# EAGLE design rock-climbing-timer (EAGLE 9.6.2)
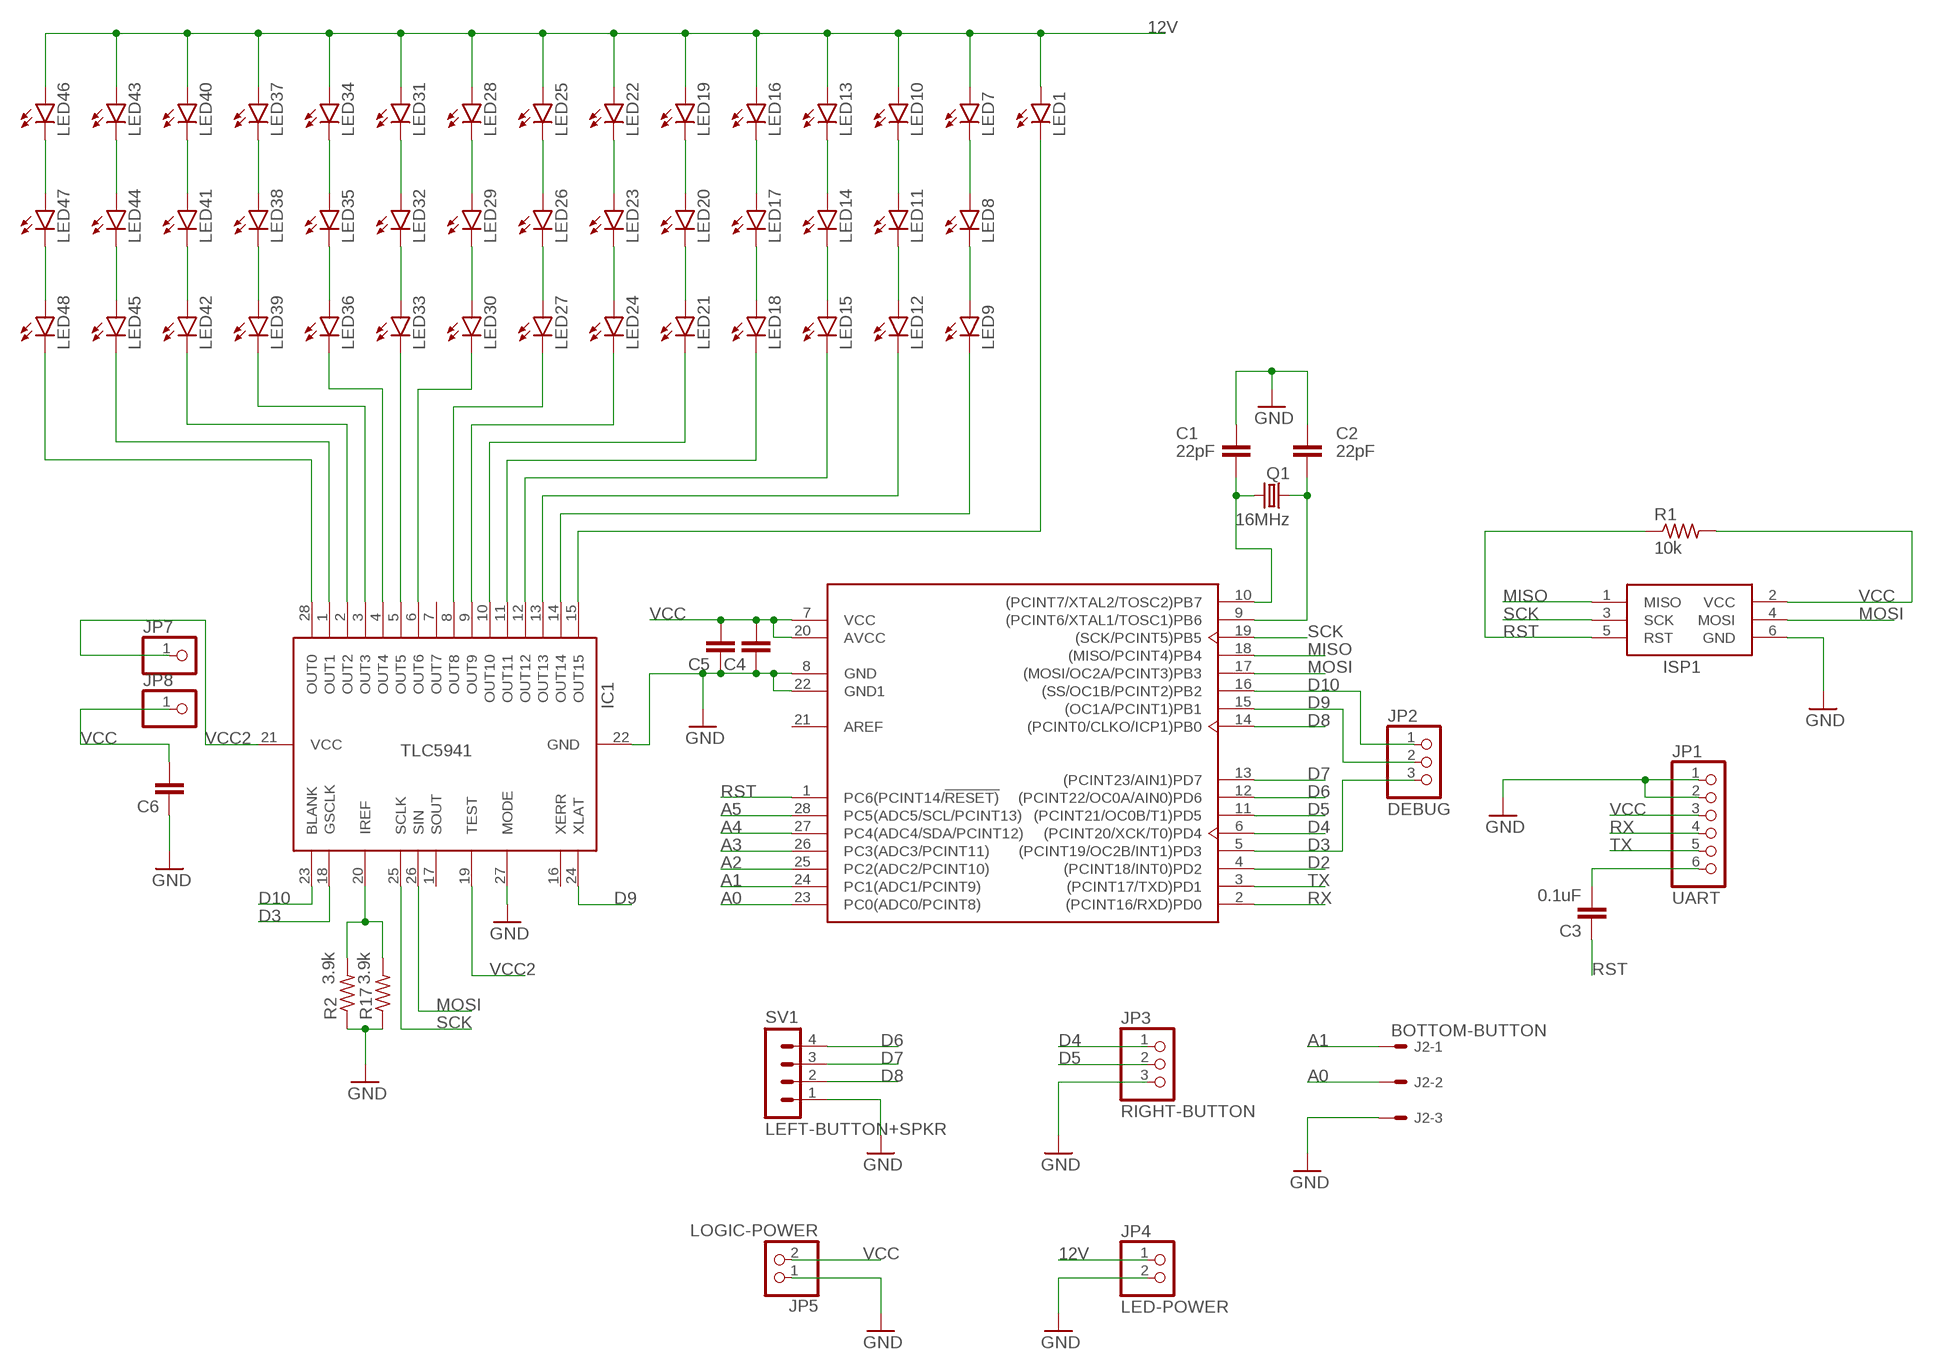
[diagram p0: schematic, sheet 1]

## Parts
C1  22pF  C5/2.5  [C5B2.5]
C2  22pF  C5/2.5  [C5B2.5]
C3  0.1uF  C5/2.5  [C5B2.5]
C4  C5/2.5  [C5B2.5]
C5  C5/2.5  [C5B2.5]
C6  C5/2.5  [C5B2.5]
IC1  TLC5941NT  [DIL28-3]
ISP1  AVRISP-6  [AVRISP]
J2  BOTTOM-BUTTON  22-27-2031-03  [6410-03]
JP1  UART  PINHD-1X6  [1X06]
JP2  DEBUG  PINHD-1X3  [1X03]
JP3  RIGHT-BUTTON  PINHD-1X3  [1X03]
JP4  LED-POWER  PINHD-1X2  [1X02]
JP5  LOGIC-POWER  PINHD-1X2  [1X02]
JP7  PINHD-1X1CB  [1X01-CLEANBIG]
JP8  PINHD-1X1CB  [1X01-CLEANBIG]
LED1  LED5MM  [LED5MM]
LED7  LED5MM  [LED5MM]
LED8  LED5MM  [LED5MM]
LED9  LED5MM  [LED5MM]
LED10  LED5MM  [LED5MM]
LED11  LED5MM  [LED5MM]
LED12  LED5MM  [LED5MM]
LED13  LED5MM  [LED5MM]
LED14  LED5MM  [LED5MM]
LED15  LED5MM  [LED5MM]
LED16  LED5MM  [LED5MM]
LED17  LED5MM  [LED5MM]
LED18  LED5MM  [LED5MM]
LED19  LED5MM  [LED5MM]
LED20  LED5MM  [LED5MM]
LED21  LED5MM  [LED5MM]
LED22  LED5MM  [LED5MM]
LED23  LED5MM  [LED5MM]
LED24  LED5MM  [LED5MM]
LED25  LED5MM  [LED5MM]
LED26  LED5MM  [LED5MM]
LED27  LED5MM  [LED5MM]
LED28  LED5MM  [LED5MM]
LED29  LED5MM  [LED5MM]
LED30  LED5MM  [LED5MM]
LED31  LED5MM  [LED5MM]
LED32  LED5MM  [LED5MM]
LED33  LED5MM  [LED5MM]
LED34  LED5MM  [LED5MM]
LED35  LED5MM  [LED5MM]
LED36  LED5MM  [LED5MM]
LED37  LED5MM  [LED5MM]
LED38  LED5MM  [LED5MM]
LED39  LED5MM  [LED5MM]
LED40  LED5MM  [LED5MM]
LED41  LED5MM  [LED5MM]
LED42  LED5MM  [LED5MM]
LED43  LED5MM  [LED5MM]
LED44  LED5MM  [LED5MM]
LED45  LED5MM  [LED5MM]
LED46  LED5MM  [LED5MM]
LED47  LED5MM  [LED5MM]
LED48  LED5MM  [LED5MM]
Q1  16MHz  CRYSTALHC49S  [HC49/S]
R1  10k  R-US_0207/10  [0207/10]
R2  3.9k  R-US_0207/10  [0207/10]
R17  3.9k  R-US_0207/10  [0207/10]
SV1  LEFT-BUTTON+SPKR  MA04-1  [MA04-1]
U1  ATMEGA328P-PU  [DIP-28]

## Nets
12V: JP4.1 LED1.A LED7.A LED10.A LED13.A LED16.A LED19.A LED22.A LED25.A LED28.A LED31.A LED34.A LED37.A LED40.A LED43.A LED46.A
A0: J2.2 U1.23(PC0(ADC0/PCINT8))
A1: J2.1 U1.24(PC1(ADC1/PCINT9))
A2: U1.25(PC2(ADC2/PCINT10))
A3: U1.26(PC3(ADC3/PCINT11))
A4: U1.27(PC4(ADC4/SDA/PCINT12))
A5: U1.28(PC5(ADC5/SCL/PCINT13))
D2: U1.4((PCINT18/INT0)PD2)
D3: IC1.18(GSCLK) JP2.3 U1.5((PCINT19/OC2B/INT1)PD3)
D4: JP3.1 U1.6((PCINT20/XCK/T0)PD4)
D5: JP3.2 U1.11((PCINT21/OC0B/T1)PD5)
D6: SV1.4 U1.12((PCINT22/OC0A/AIN0)PD6)
D7: SV1.3 U1.13((PCINT23/AIN1)PD7)
D8: SV1.2 U1.14((PCINT0/CLKO/ICP1)PB0)
D9: IC1.24(XLAT) JP2.2 U1.15((OC1A/PCINT1)PB1)
D10: IC1.23(BLANK) JP2.1 U1.16((SS/OC1B/PCINT2)PB2)
GND: C1.1 C2.1 C4.1 C5.1 C6.1 IC1.22(GND) IC1.27(MODE) ISP1.6(GND) J2.3 JP1.1 JP1.2 JP3.3 JP4.2 JP5.1 R2.1 R17.1 SV1.1 U1.8(GND) U1.22(GND1)
MISO: ISP1.1(MISO) U1.18((MISO/PCINT4)PB4)
MOSI: IC1.26(SIN) ISP1.4(MOSI) U1.17((MOSI/OC2A/PCINT3)PB3)
N$1: C1.2 Q1.2 U1.10((PCINT7/XTAL2/TOSC2)PB7)
N$2: C2.2 Q1.1 U1.9((PCINT6/XTAL1/TOSC1)PB6)
N$3: C3.2 JP1.6
N$4: IC1.20(IREF) R2.2 R17.2
N$5: IC1.15(OUT15) LED1.K(C)
N$7: LED7.K(C) LED8.A
N$8: LED8.K(C) LED9.A
N$10: LED10.K(C) LED11.A
N$11: LED11.K(C) LED12.A
N$13: LED13.K(C) LED14.A
N$14: LED14.K(C) LED15.A
N$16: LED16.K(C) LED17.A
N$17: LED17.K(C) LED18.A
N$19: LED19.K(C) LED20.A
N$20: LED20.K(C) LED21.A
N$22: LED22.K(C) LED23.A
N$23: LED23.K(C) LED24.A
N$25: LED25.K(C) LED26.A
N$26: LED26.K(C) LED27.A
N$28: LED28.K(C) LED29.A
N$29: LED29.K(C) LED30.A
N$31: LED31.K(C) LED32.A
N$32: LED32.K(C) LED33.A
N$34: LED34.K(C) LED35.A
N$35: LED35.K(C) LED36.A
N$37: LED37.K(C) LED38.A
N$38: LED38.K(C) LED39.A
N$40: LED40.K(C) LED41.A
N$41: LED41.K(C) LED42.A
N$43: LED43.K(C) LED44.A
N$44: LED44.K(C) LED45.A
N$46: LED46.K(C) LED47.A
N$47: LED47.K(C) LED48.A
N$65: IC1.14(OUT14) LED9.K(C)
N$66: IC1.13(OUT13) LED12.K(C)
N$67: IC1.12(OUT12) LED15.K(C)
N$68: IC1.11(OUT11) LED18.K(C)
N$69: IC1.10(OUT10) LED21.K(C)
N$70: IC1.9(OUT9) LED24.K(C)
N$71: IC1.8(OUT8) LED27.K(C)
N$73: IC1.6(OUT6) LED30.K(C)
N$74: IC1.5(OUT5) LED33.K(C)
N$75: IC1.4(OUT4) LED36.K(C)
N$76: IC1.3(OUT3) LED39.K(C)
N$77: IC1.2(OUT2) LED42.K(C)
N$78: IC1.1(OUT1) LED45.K(C)
N$79: IC1.28(OUT0) LED48.K(C)
RST: C3.1 ISP1.5(RST) R1.1 U1.1(PC6(PCINT14/!RESET))
RX: JP1.4 U1.2((PCINT16/RXD)PD0)
SCK: IC1.25(SCLK) ISP1.3(SCK) U1.19((SCK/PCINT5)PB5)
TX: JP1.5 U1.3((PCINT17/TXD)PD1)
VCC: C4.2 C5.2 C6.2 ISP1.2(VCC) JP1.3 JP5.2 JP8.1 R1.2 U1.7(VCC) U1.20(AVCC)
VCC2: IC1.19(TEST) IC1.21(VCC) JP7.1
Unconnected: IC1.7(OUT7) IC1.16(XERR) IC1.17(SOUT) U1.21(AREF)

## Library data of the parts
C1-C6 = capacitor-wima:C: CAPACITOR naming: grid - package width
IC1 = adafruit:TLC5941
ISP1 = adafruit:AVRISP: AVR ISP HEADER Standard 6 pin header for AVR programming
J2 = con-molex:22-?-03: CONNECTOR wire to board 2.54 mm (.1 inch) pitch header; MF: MOLEX; OC_FARNELL: unknown; OC_NEWARK: unknown
JP1 = adafruit:PINHD-1X6: PIN HEADER
JP2 JP3 = pinhead:PINHD-1X3: PIN HEADER
JP4 JP5 = Connector:PINHD-1X2: PIN HEADER; CATEGORY: CONNECTOR; SUB-CATEGORY: PIN-HEADER
JP7 JP8 = adafruit:PINHD-1X1: Pin header 1x1 for 0.1" spacing With round pins
LED1 LED7-LED48 = led:LED: LED OSRAM: - CHIPLED LG R971, LG N971, LY N971, LG Q971, LY Q971, LO R971, LY R971 LH N974, LH R974 LS Q976, LO Q976, LY Q976 LO Q996 - Hyper CHIPLED LW Q18S LB Q993, LB Q99A, LB R99A - SideLED LS A670, LO A670, LY A670, LG A670, LP A670 LB A673, LV A673, LT A673, LW A673 LH A674 LY A675 LS A676, LA A676, LO A676, LY A676, LW A676 LS A679, LY A679, LG A679 - Hyper Micro SIDELED® LS Y876, LA Y876, LO Y876, LY Y876 LT Y87S - SmartLED LW L88C, LW L88S LB L89C, LB L89S, LG L890 LS L89K, LO L89K, LY L89K LS L896, LA L896, LO L896, LY L896 - TOPLED LS T670, LO T670, LY T670, LG T670, LP T670 LSG T670, LSP T670, LSY T670, LOP T670, LYG T670 LG T671, LOG T671, LSG T671 LB T673, LV T673, LT T673, LW T673 LH T674 LS T676, LA T676, LO T676, LY T676, LB T676, LH T676, LSB T676, LW T676 LB T67C, LV T67C, LT T67C, LS T67K, LO T67K, LY T67K, LW E67C LS E67B, LA E67B, LO E67B, LY E67B, LB E67C, LV E67C, LT E67C LW T67C LS T679, LY T679, LG T679 LS T770, LO T770, LY T770, LG T770, LP T770 LB T773, LV T773, LT T773, LW T773 LH T774 LS E675, LA E675, LY E675, LS T675 LS T776, LA T776, LO T776, LY T776, LB T776 LHGB T686 LT T68C, LB T68C - Hyper Mini TOPLED® LB M676 - Mini TOPLED Santana® LG M470 LS M47K, LO M47K, LY M47K Source: http://www.osram.convergy.de LUXEON: - LUMILED® LXK2-PW12-R00, LXK2-PW12-S00, LXK2-PW14-U00, LXK2-PW14-V00 LXK2-PM12-R00, LXK2-PM12-S00, LXK2-PM14-U00 LXK2-PE12-Q00, LXK2-PE12-R00, LXK2-PE12-S00, LXK2-PE14-T00, LXK2-PE14-U00 LXK2-PB12-K00, LXK2-PB12-L00, LXK2-PB12-M00, LXK2-PB14-N00, LXK2-PB14-P00, LXK2-PB14-Q00 LXK2-PR12-L00, LXK2-PR12-M00, LXK2-PR14-Q00, LXK2-PR14-R00 LXK2-PD12-Q00, LXK2-PD12-R00, LXK2-PD12-S00 LXK2-PH12-R00, LXK2-PH12-S00 LXK2-PL12-P00, LXK2-PL12-Q00, LXK2-PL12-R00 Source: www.luxeon.com KINGBRIGHT: KA-3528ASYC Source: www.kingbright.com
Q1 = crystal:CRYSTAL: CRYSTAL; OC_FARNELL: 1667008; OC_NEWARK: unknown
R1 R2 R17 = resistor:R-US_: RESISTOR, American symbol
SV1 = con-lstb:MA04-1: PIN HEADER; OC_FARNELL: unknown; OC_NEWARK: unknown
U1 = Microcontroller:ATMEGA328P-PU: IC MCU 8BIT 32KB FLASH 28DIP Manufacturer's datasheet <http://ww1.microchip.com/downloads/en/DeviceDoc/ATmega48A-PA-88A-PA-168A-PA-328-P-DS-DS40002061A.pdf>; CREATED_BY: PCBLayout.com; DIGIKEY_PART_NUMBER: ATMEGA328P-PU-ND; MANUFACTURER: Microchip Technology; MPN: ATMEGA328P-PU; PACKAGE: DIP-28

## Board
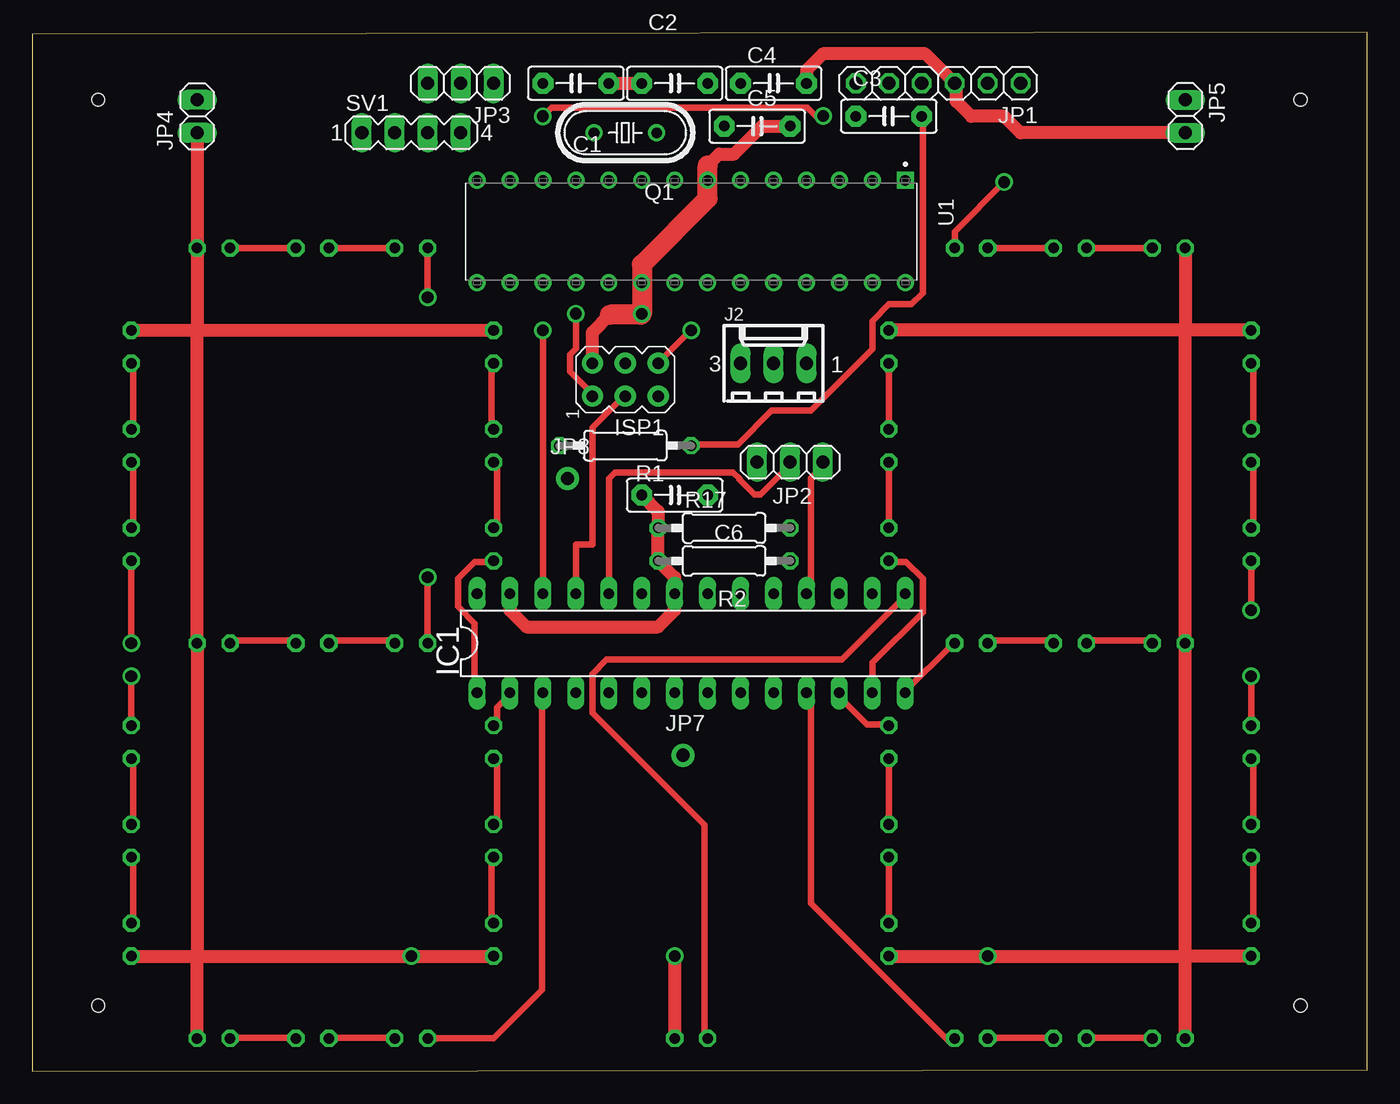
[diagram p1: board, top side]
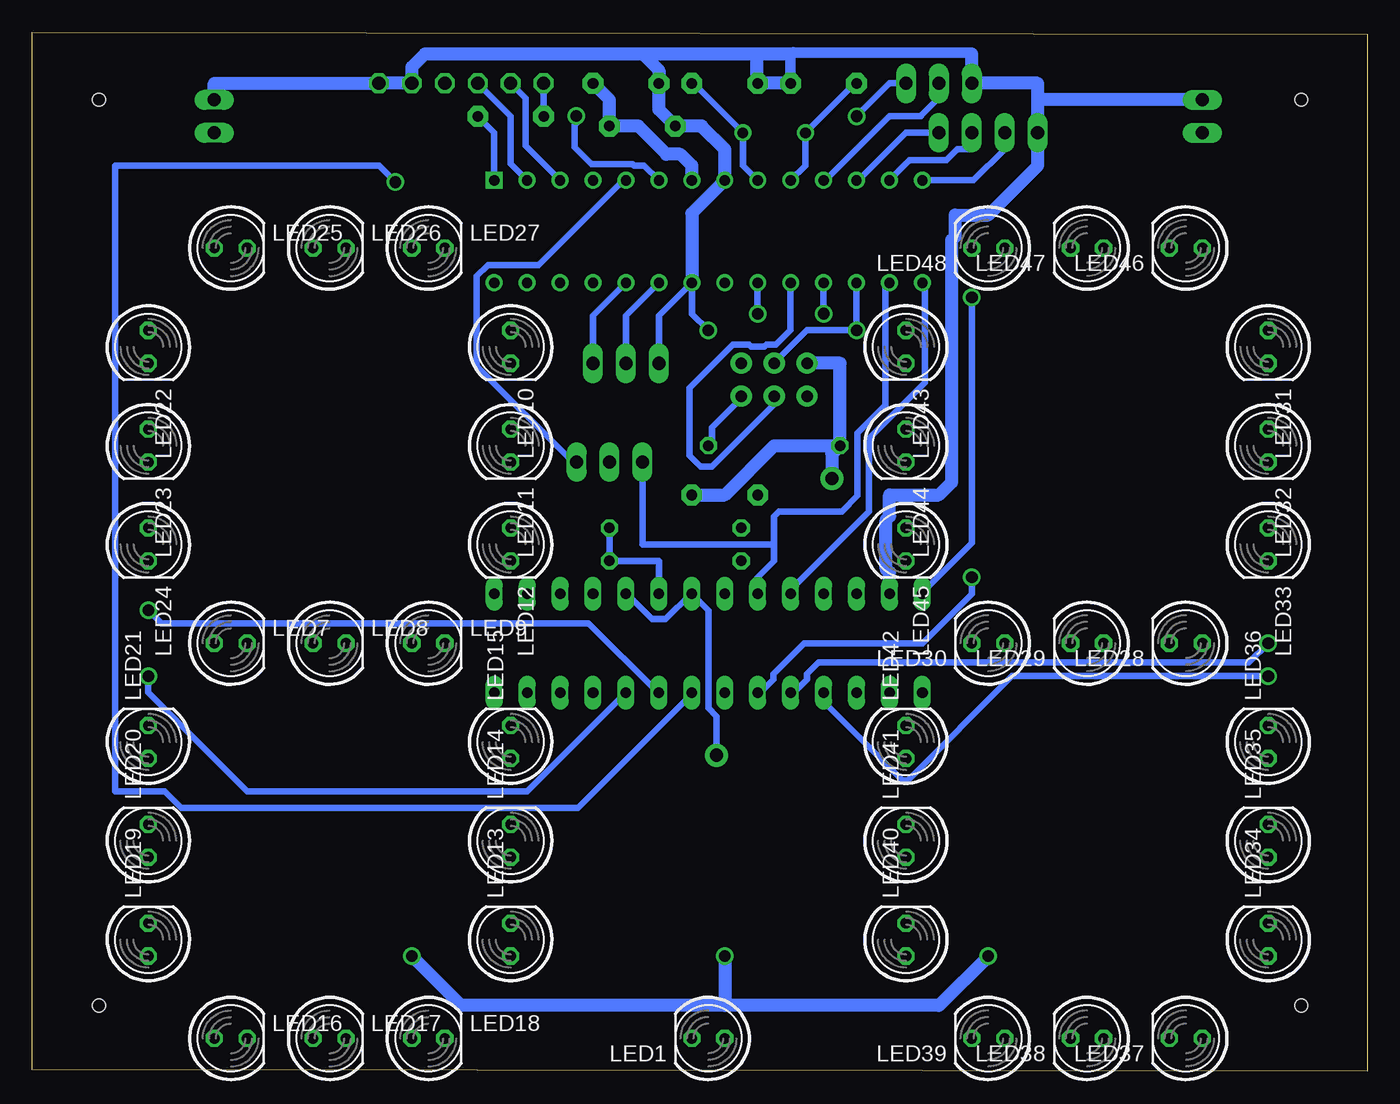
[diagram p2: board, bottom side, seen from below]

Size 102.92 x 80.13 mm. Coordinates in mm from the lower left corner, seen from the top.
Outline: 0,0 102.92,0.13 102.92,80.13 0,80 0,0
Copper layers (1*16): Top 0.035mm / dielectric 1.5mm / Bottom 0.035mm
Design rules "default *": minimum track width 20mil, minimum drill 0.35mm, track to track 14mil, track to pad 14mil, pad to pad 14mil, via to via 14mil, smd to smd 14mil, copper to edge 40mil, drill to drill 14mil, minimum pad ring 10mil, minimum via ring 8mil, stop-mask expansion 4mil, vias tented up to drill 0mil, thermal gap 14mil
Holes 1 mm at 5.08,74.93 5.08,5.08 97.79,5.08 97.79,74.93
vRestrict: area 0,0 to 100.3,80

### Footprints (pad centres in the part's own frame; a part is rotated, then mirrored left to right if it is on the bottom)
C5B2.5 = drill 0.813 pad 1.6 octagon: 1 -2.54,0; 2 2.54,0
DIL28-3 = drill 0.813 long: 1 -16.51,-3.81; 2 -13.97,-3.81; 3 -11.43,-3.81; 4 -8.89,-3.81; 5 -6.35,-3.81; 6 -3.81,-3.81; 7 -1.27,-3.81; 8 1.27,-3.81; 9 3.81,-3.81; 10 6.35,-3.81; 11 8.89,-3.81; 12 11.43,-3.81; 13 13.97,-3.81; 14 16.51,-3.81; 15 16.51,3.81; 16 13.97,3.81; 17 11.43,3.81; 18 8.89,3.81; 19 6.35,3.81; 20 3.81,3.81; 21 1.27,3.81; 22 -1.27,3.81; 23 -3.81,3.81; 24 -6.35,3.81; 25 -8.89,3.81; 26 -11.43,3.81; 27 -13.97,3.81; 28 -16.51,3.81
AVRISP = drill 0.9 pad 1.626: 1 -1.27,2.54; 2 1.27,2.54; 3 -1.27,0; 4 1.27,0; 5 -1.27,-2.54; 6 1.27,-2.54
6410-03 = drill 1.016 long: 1 2.54,0; 2 0,0; 3 -2.54,0
1X06 = drill 1.016 octagon: 1 -6.35,0; 2 -3.81,0; 3 -1.27,0; 4 1.27,0; 5 3.81,0; 6 6.35,0
1X03 = drill 1.016 long: 1 -2.54,0; 2 0,0; 3 2.54,0
1X02 = drill 1.016 long: 1 -1.27,0; 2 1.27,0
1X01-CLEANBIG = drill 1.016 pad 1.778: 1 0,0
LED5MM = drill 0.813 octagon: A -1.27,0; K 1.27,0
HC49/S = drill 0.813: 1 -2.413,0; 2 2.413,0
0207/10 = drill 0.813 octagon: 1 -5.08,0; 2 5.08,0
MA04-1 = drill 1.016 long: 1 -3.81,0; 2 -1.27,0; 3 1.27,0; 4 3.81,0
DIP-28 = drill 0.79 pad 1.19 square: 1 -3.95,16.51 | drill 0.79 pad 1.19: 2 -3.95,13.97; 3 -3.95,11.43; 4 -3.95,8.89; 5 -3.95,6.35; 6 -3.95,3.81; 7 -3.95,1.27; 8 -3.95,-1.27; 9 -3.95,-3.81; 10 -3.95,-6.35; 11 -3.95,-8.89; 12 -3.95,-11.43; 13 -3.95,-13.97; 14 -3.95,-16.51; 15 3.95,-16.51; 16 3.95,-13.97; 17 3.95,-11.43; 18 3.95,-8.89; 19 3.95,-6.35; 20 3.95,-3.81; 21 3.95,-1.27; 22 3.95,1.27; 23 3.95,3.81; 24 3.95,6.35; 25 3.95,8.89; 26 3.95,11.43; 27 3.95,13.97; 28 3.95,16.51

### Placement (x,y rotation side)
C1  41.91,76.2 180 top
C2  49.53,76.2 0 top
C3  66.04,73.66 180 top
C4  57.15,76.2 0 top
C5  55.88,72.9 0 top
C6  49.53,44.45 0 top
IC1  50.8,33.02 0 top
ISP1  45.72,53.34 90 top
J2  57.15,54.61 0 top
JP1  69.85,76.2 180 top
JP2  58.42,46.99 0 top
JP3  33.02,76.2 180 top
JP4  12.7,73.66 90 top
JP5  88.9,73.66 270 top
JP7  50.16,24.38 0 top
JP8  41.27,45.72 0 top
LED1  50.8,2.54 180 bottom
LED7  87.63,33.02 0 bottom
LED8  80.01,33.02 0 bottom
LED9  72.39,33.02 0 bottom
LED10  66.04,55.88 270 bottom
LED11  66.04,48.26 270 bottom
LED12  66.04,40.64 270 bottom
LED13  66.04,10.16 90 bottom
LED14  66.04,17.78 90 bottom
LED15  66.04,25.4 90 bottom
LED16  87.63,2.54 0 bottom
LED17  80.01,2.54 0 bottom
LED18  72.39,2.54 0 bottom
LED19  93.98,10.16 90 bottom
LED20  93.98,17.78 90 bottom
LED21  93.98,25.4 90 bottom
LED22  93.98,55.88 270 bottom
LED23  93.98,48.26 270 bottom
LED24  93.98,40.64 270 bottom
LED25  87.63,63.5 0 bottom
LED26  80.01,63.5 0 bottom
LED27  72.39,63.5 0 bottom
LED28  13.97,33.02 180 bottom
LED29  21.59,33.02 180 bottom
LED30  29.21,33.02 180 bottom
LED31  7.62,55.88 270 bottom
LED32  7.62,48.26 270 bottom
LED33  7.62,40.64 270 bottom
LED34  7.62,10.16 90 bottom
LED35  7.62,17.78 90 bottom
LED36  7.62,25.4 90 bottom
LED37  13.97,2.54 180 bottom
LED38  21.59,2.54 180 bottom
LED39  29.21,2.54 180 bottom
LED40  35.56,10.16 90 bottom
LED41  35.56,17.78 90 bottom
LED42  35.56,25.4 90 bottom
LED43  35.56,55.88 270 bottom
LED44  35.56,48.26 270 bottom
LED45  35.56,40.64 270 bottom
LED46  13.97,63.5 180 bottom
LED47  21.59,63.5 180 bottom
LED48  29.21,63.5 180 bottom
Q1  45.72,72.39 180 top
R1  45.72,48.26 180 top
R2  53.34,39.37 0 top
R17  53.34,41.91 0 top
SV1  29.21,72.39 0 top
U1  50.8,64.77 270 top

### Tracks (layer width: path | path; a pad name or v marks a point on that pad's centre or on a via)
12V  (via drill 0.9)
  Top 0.508: 88.95,33.25 LED7.A
  Top 1.016: LED31.A 12.7,57.15 | 12.7,57.15 LED43.A | 12.7,57.15 LED28.A 12.7,8.89 | LED37.A 12.7,8.89 | LED34.A 12.7,8.89 | 12.7,8.89 v29.21,8.89 LED40.A | 88.9,8.89 v73.66,8.89 LED13.A | LED19.A 88.9,8.89 | LED16.A 88.9,8.89 | 88.9,8.89 88.9,33.2 88.95,33.25 | LED7.A 88.9,57.15 | LED25.A 88.9,57.15 | LED22.A 88.9,57.15 | 88.9,57.15 LED10.A | 12.7,57.15 LED46.A JP4.1 | v49.53,8.89 LED1.A
  Bottom 1.016: v29.21,8.89 33.02,5.08 49.53,5.08 | v73.66,8.89 69.85,5.08 49.53,5.08 | v49.53,8.89 49.53,5.08
A0
  Bottom 0.508: U1.23 57.15,58.28 J2.2
A1
  Bottom 0.508: U1.24 59.69,58.28 J2.1
D3
  Top 0.508: IC1.18 60.02,37.13 60.02,45.77 60.88,46.63 JP2.3
  Bottom 0.508: U1.5 57.43,68.66 63.91,62.18 67.79,62.18 68.66,61.32 68.66,54.41 61.32,47.07 JP2.3
D4  (via drill 0.9)
  Top 0.508: v60.98,73.69 60.96,73.66 60.41,73.66 59.77,74.31 40.02,74.31 v39.37,73.66
  Bottom 0.508: JP3.1 36.83,76.2 v39.37,73.66 | v60.98,73.69 60.98,73.09 61.1,72.97 61.1,71.26 59.82,69.98 56.63,69.98 56.5,69.85 55.74,69.85 U1.6
D5
  Bottom 0.508: U1.11 41.77,68.72 36.83,73.66 34.39,73.66 34.39,73.72 33.02,75.09 JP3.2
D6
  Bottom 0.508: SV1.4 35.56,72.39 39.23,68.72 U1.12
D7
  Bottom 0.508: U1.13 35.29,70.26 32.45,70.26 31.59,71.12 30.48,71.12 SV1.3
D8
  Bottom 0.508: U1.14 30.34,68.72 27.94,71.12 SV1.2
D9
  Top 0.508: JP2.2 58.29,46.63 56.13,44.48 55.69,44.48 54.51,45.66 54.51,45.72 54.03,46.2 44.93,46.2 44.45,45.72 IC1.24
  Bottom 0.508: U1.15 34.11,60.45 34.11,53.11 38.43,48.79 38.43,43.18 44.48,37.13 IC1.24
D10
  Bottom 0.508: U1.16 37.13,60.45 37.13,51.38 39.29,49.23 39.29,44.4 40.51,43.18 45.34,43.18 45.72,42.8 45.72,40.64 | IC1.23 46.99,38.1 45.72,39.37 45.72,40.64 | 45.72,40.64 55.88,40.64 JP2.1
GND  (via drill 0.9)
  Top 0.508: v50.8,57.15 ISP1.6
  Top 1.016: IC1.27 36.83,35.56 38.1,34.29 48.26,34.29 49.53,35.56 IC1.22 49.53,38.1 R2.1 R17.1 48.26,43.18 C6.1 | C1.1 C2.1
  Bottom 0.508: 25.48,72.11 SV1.1 | 52.25,60.45 U1.22 | 49.66,68.66 U1.8 | 51.82,60.88 U1.22 | 73.41,76.43 JP1.2 | U1.22 54.61,58.28 J2.3 | U1.22 52.07,58.42 v50.8,57.15
  Bottom 0.61: 44.45,78.48 44.25,78.68
  Bottom 0.813: 30.48,78.48 30.58,78.58 44.25,78.58 44.45,78.37 C1.1 | 46.86,76.2 47.07,76
  Bottom 1.016: JP5.1 88.9,76.2 JP1.1 JP1.2 73.66,77.47 72.65,78.48 55.88,78.48 | 55.88,78.48 54.61,77.21 C4.1 54.61,74.17 C5.1 51.31,72.9 49.53,71.12 U1.8 52.07,66.18 U1.22 | 55.88,78.48 46.99,78.48 | 46.99,78.48 44.45,78.48 | 46.99,78.48 47.07,78.4 47.07,76 | 25.4,74.93 SV1.1 25.4,69.85 29.21,66.04 31.75,66.04 31.75,64.39 32.02,64.12 32.02,45.45 33.02,44.45 36.83,44.45 36.83,42.8 37.08,42.54 37.08,38.74 36.83,38.48 IC1.27 | JP4.2 25.4,74.93 | 25.4,74.93 25.4,76.2 JP3.3 30.48,78.48 | C1.1 46.86,76.2
MISO  (via drill 0.9)
  Top 0.508: ISP1.1 43.18,52.25 41.45,53.98 41.45,55.27 41.91,55.73 v41.91,58.44
  Bottom 0.508: v41.91,58.44 U1.18
MOSI  (via drill 0.9)
  Top 0.508: IC1.26 v39.37,57.15
  Bottom 0.508: U1.17 v39.37,57.15 43.18,57.15 ISP1.4
N$1
  Bottom 0.508: U1.10 43.31,69.86 Q1.2 39.5,76.2 C1.2
N$2
  Bottom 0.508: U1.9 48.13,69.86 Q1.1 51.94,76.2 C2.2
N$3
  Bottom 0.508: C3.2 JP1.6
N$4
  Bottom 0.508: IC1.20 54.61,39.37 R2.2 R17.2
N$5
  Top 0.508: LED1.K 51.82,2.59 51.82,19 43.18,27.64 43.18,30.66 44.27,31.75 62.41,31.75 67.36,36.7 IC1.15
N$7
  Top 0.508: LED8.A 81.61,33.25 86.36,33.25 LED7.K
N$8
  Top 0.508: LED9.A 73.84,33.25 78.59,33.25 LED8.K
N$10
  Top 0.508: LED11.A 66.06,49.66 66.06,54.41 LED10.K
N$11
  Top 0.508: LED12.A 66.06,42.32 66.06,46.63 LED11.K
N$13
  Top 0.508: LED13.K 66.06,11.66 66.06,16.41 LED14.A
N$14
  Top 0.508: LED14.K 66.06,19.43 66.06,23.75 LED15.A
N$16
  Top 0.508: LED17.A 81.61,2.59 86.36,2.59 LED16.K
N$17
  Top 0.508: LED18.A 73.84,2.59 78.59,2.59 LED17.K
N$19
  Top 0.508: LED19.K 94.13,11.66 94.13,16.41 LED20.A
N$20
  Top 0.508: LED20.K 94.13,19.43 94.13,23.75 LED21.A
N$22
  Top 0.508: LED23.A 94.13,49.66 94.13,54.41 LED22.K
N$23
  Top 0.508: LED24.A 94.13,42.32 94.13,46.63 LED23.K
N$25
  Top 0.508: LED26.A 81.61,63.48 86.36,63.48 LED25.K
N$26
  Top 0.508: LED27.A 73.84,63.48 78.59,63.48 LED26.K
N$28
  Top 0.508: LED28.K 15.54,33.25 20.3,33.25 LED29.A
N$29
  Top 0.508: LED29.K 22.89,33.25 27.64,33.25 LED30.A
N$31
  Top 0.508: LED32.A 7.77,49.66 7.77,54.41 LED31.K
N$32
  Top 0.508: LED33.A 7.77,42.32 7.77,46.63 LED32.K
N$34
  Top 0.508: LED34.K 7.77,11.66 7.77,16.41 LED35.A
N$35
  Top 0.508: LED35.K 7.77,19.43 7.77,23.75 LED36.A
N$37
  Top 0.508: LED37.K 15.54,2.59 20.3,2.59 LED38.A
N$38
  Top 0.508: LED38.K 22.89,2.59 27.64,2.59 LED39.A
N$40
  Top 0.508: LED40.K 35.41,11.66 35.41,16.41 LED41.A
N$41
  Top 0.508: LED41.K 35.84,19.43 35.84,23.75 LED42.A
N$43
  Top 0.508: LED44.A 35.41,49.66 35.41,54.41 LED43.K
N$44
  Top 0.508: LED45.A 35.84,42.32 35.84,46.63 LED44.K
N$46
  Top 0.508: LED46.K 15.54,63.48 20.3,63.48 LED47.A
N$47
  Top 0.508: LED47.K 22.89,63.48 27.64,63.48 LED48.A
N$65
  Top 0.508: IC1.14 67.36,29.36 70.81,32.82 LED9.K
N$66
  Top 0.508: IC1.13 64.77,31.52 68.66,35.41 68.66,38 67.36,39.29 66.06,39.29 LED12.K
N$67
  Top 0.508: LED15.K 65.63,26.77 64.34,26.77 62.18,28.93 IC1.12
N$68
  Top 0.508: IC1.11 60.02,28.93 60.02,12.95 70.81,2.16 LED18.K
N$69  (via drill 0.9)
  Top 0.508: v93.98,30.48 LED21.K
  Bottom 0.508: IC1.10 64.77,21.59 86.36,21.59 93.98,29.21 v93.98,30.48
N$70  (via drill 0.9)
  Top 0.508: LED24.K v93.98,35.56
  Bottom 0.508: IC1.9 54.84,29.36 60.02,34.54 92.96,34.54 v93.98,35.56
N$71  (via drill 0.9)
  Top 0.508: v74.93,68.58 71.12,64.77 LED27.K
  Bottom 0.508: IC1.8 52.25,28.93 60.86,20.32 91.44,20.32 92.71,21.59 96.52,21.59 96.52,69.85 76.2,69.85 v74.93,68.58
N$73  (via drill 0.9)
  Top 0.508: v30.48,38.1 LED30.K
  Bottom 0.508: IC1.6 46.63,29.36 45.77,30.23 45.77,30.66 43.41,33.02 34.29,33.02 30.48,36.83 v30.48,38.1
N$74  (via drill 0.9)
  Top 0.508: LED33.K v7.62,33.02
  Bottom 0.508: IC1.5 44.04,29.36 43.18,30.23 43.18,30.66 42.32,31.52 9.12,31.52 v7.62,33.02
N$75  (via drill 0.9)
  Top 0.508: v7.62,30.48 LED36.K
  Bottom 0.508: IC1.4 42.32,28.93 35.84,22.45 35.41,22.45 27.38,30.48 v7.62,30.48
N$76
  Top 0.508: IC1.3 39.29,28.93 39.29,6.27 35.56,2.54 LED39.K
N$77
  Top 0.508: LED42.K 35.84,26.77 35.84,28.07 36.7,28.93 IC1.2
N$78
  Top 0.508: IC1.1 34.11,29.36 34.11,34.54 32.82,35.84 32.82,38 34.11,39.29 35.41,39.29 LED45.K
N$79  (via drill 0.9)
  Top 0.508: v30.48,59.69 LED48.K
  Bottom 0.508: IC1.28 34.11,37.13 30.48,40.77 v30.48,59.69
RST
  Top 0.508: R1.1 50.95,48.36 54.41,48.36 57,50.95 60.02,50.95 64.77,55.7 64.77,57.86 66.06,59.16 67.79,59.16 68.66,60.02 68.66,73.58 C3.1
  Bottom 0.508: R1.1 50.52,48.36 50.52,49.66 48.36,51.82 ISP1.5 | U1.1 67.31,72.39 C3.1
RX
  Bottom 0.508: U1.2 66.04,69.99 66.04,73.66 JP1.4
SCK
  Top 0.508: IC1.25 41.91,40.64 43.18,40.64 43.18,49.66 45.34,51.82 ISP1.3
  Bottom 0.508: ISP1.3 45.34,51.82 50.52,46.63 51.38,46.63 52.25,47.5 52.25,52.68 48.9,56.03 47.67,56.03 47.52,55.88 46.46,55.88 46.31,56.03 45.57,56.03 44.45,57.15 U1.19
TX
  Bottom 0.508: U1.3 64.91,71.4 64.91,75.07 JP1.5
VCC  (via drill 0.9)
  Top 0.508: 71.25,76 JP1.3
  Top 1.016: JP5.2 76.2,72.39 74.93,73.66 72.39,73.66 71.25,74.8 71.25,76 | ISP1.2 43.18,57.01 44.52,58.35 | U1.7 52.07,67.31 | JP1.3 68.84,78.48 60.96,78.48 59.69,77.21 C4.2 | 52.07,69.85 52.96,70.74 54.1,70.74 56.26,72.9 C5.2
  Top 1.27: U1.20 46.99,62.23
  Top 1.524: 52.07,69.85 52.07,67.31 46.99,62.23 v46.99,58.42 46.92,58.35 44.52,58.35
  Bottom 0.508: U1.20 v46.99,58.42
  Bottom 1.016: C6.2 49.53,44.45 45.72,48.26 R1.2 | R1.2 40.64,54.61 ISP1.2 | C4.2 58.42,74.93 C5.2 56.2,72.9 54.03,70.73 52.95,70.73 52.07,69.85 U1.7 | R1.2 41.27,47.62 JP8.1
VCC2
  Bottom 0.508: JP7.1 50.16,27.39 50.8,28.02 50.8,35.56 IC1.21 52.15,36.83 54.08,34.9 55.14,34.9 57.07,36.83 IC1.19